# EasyEDA schematic SCH_nfcCard_2025-11-06.json
TITLE: Sheet_1; REV: 1.0; Date: 2025-11-06; Sheet: 1/1; Drawn By: thiumli; Company: Your Company
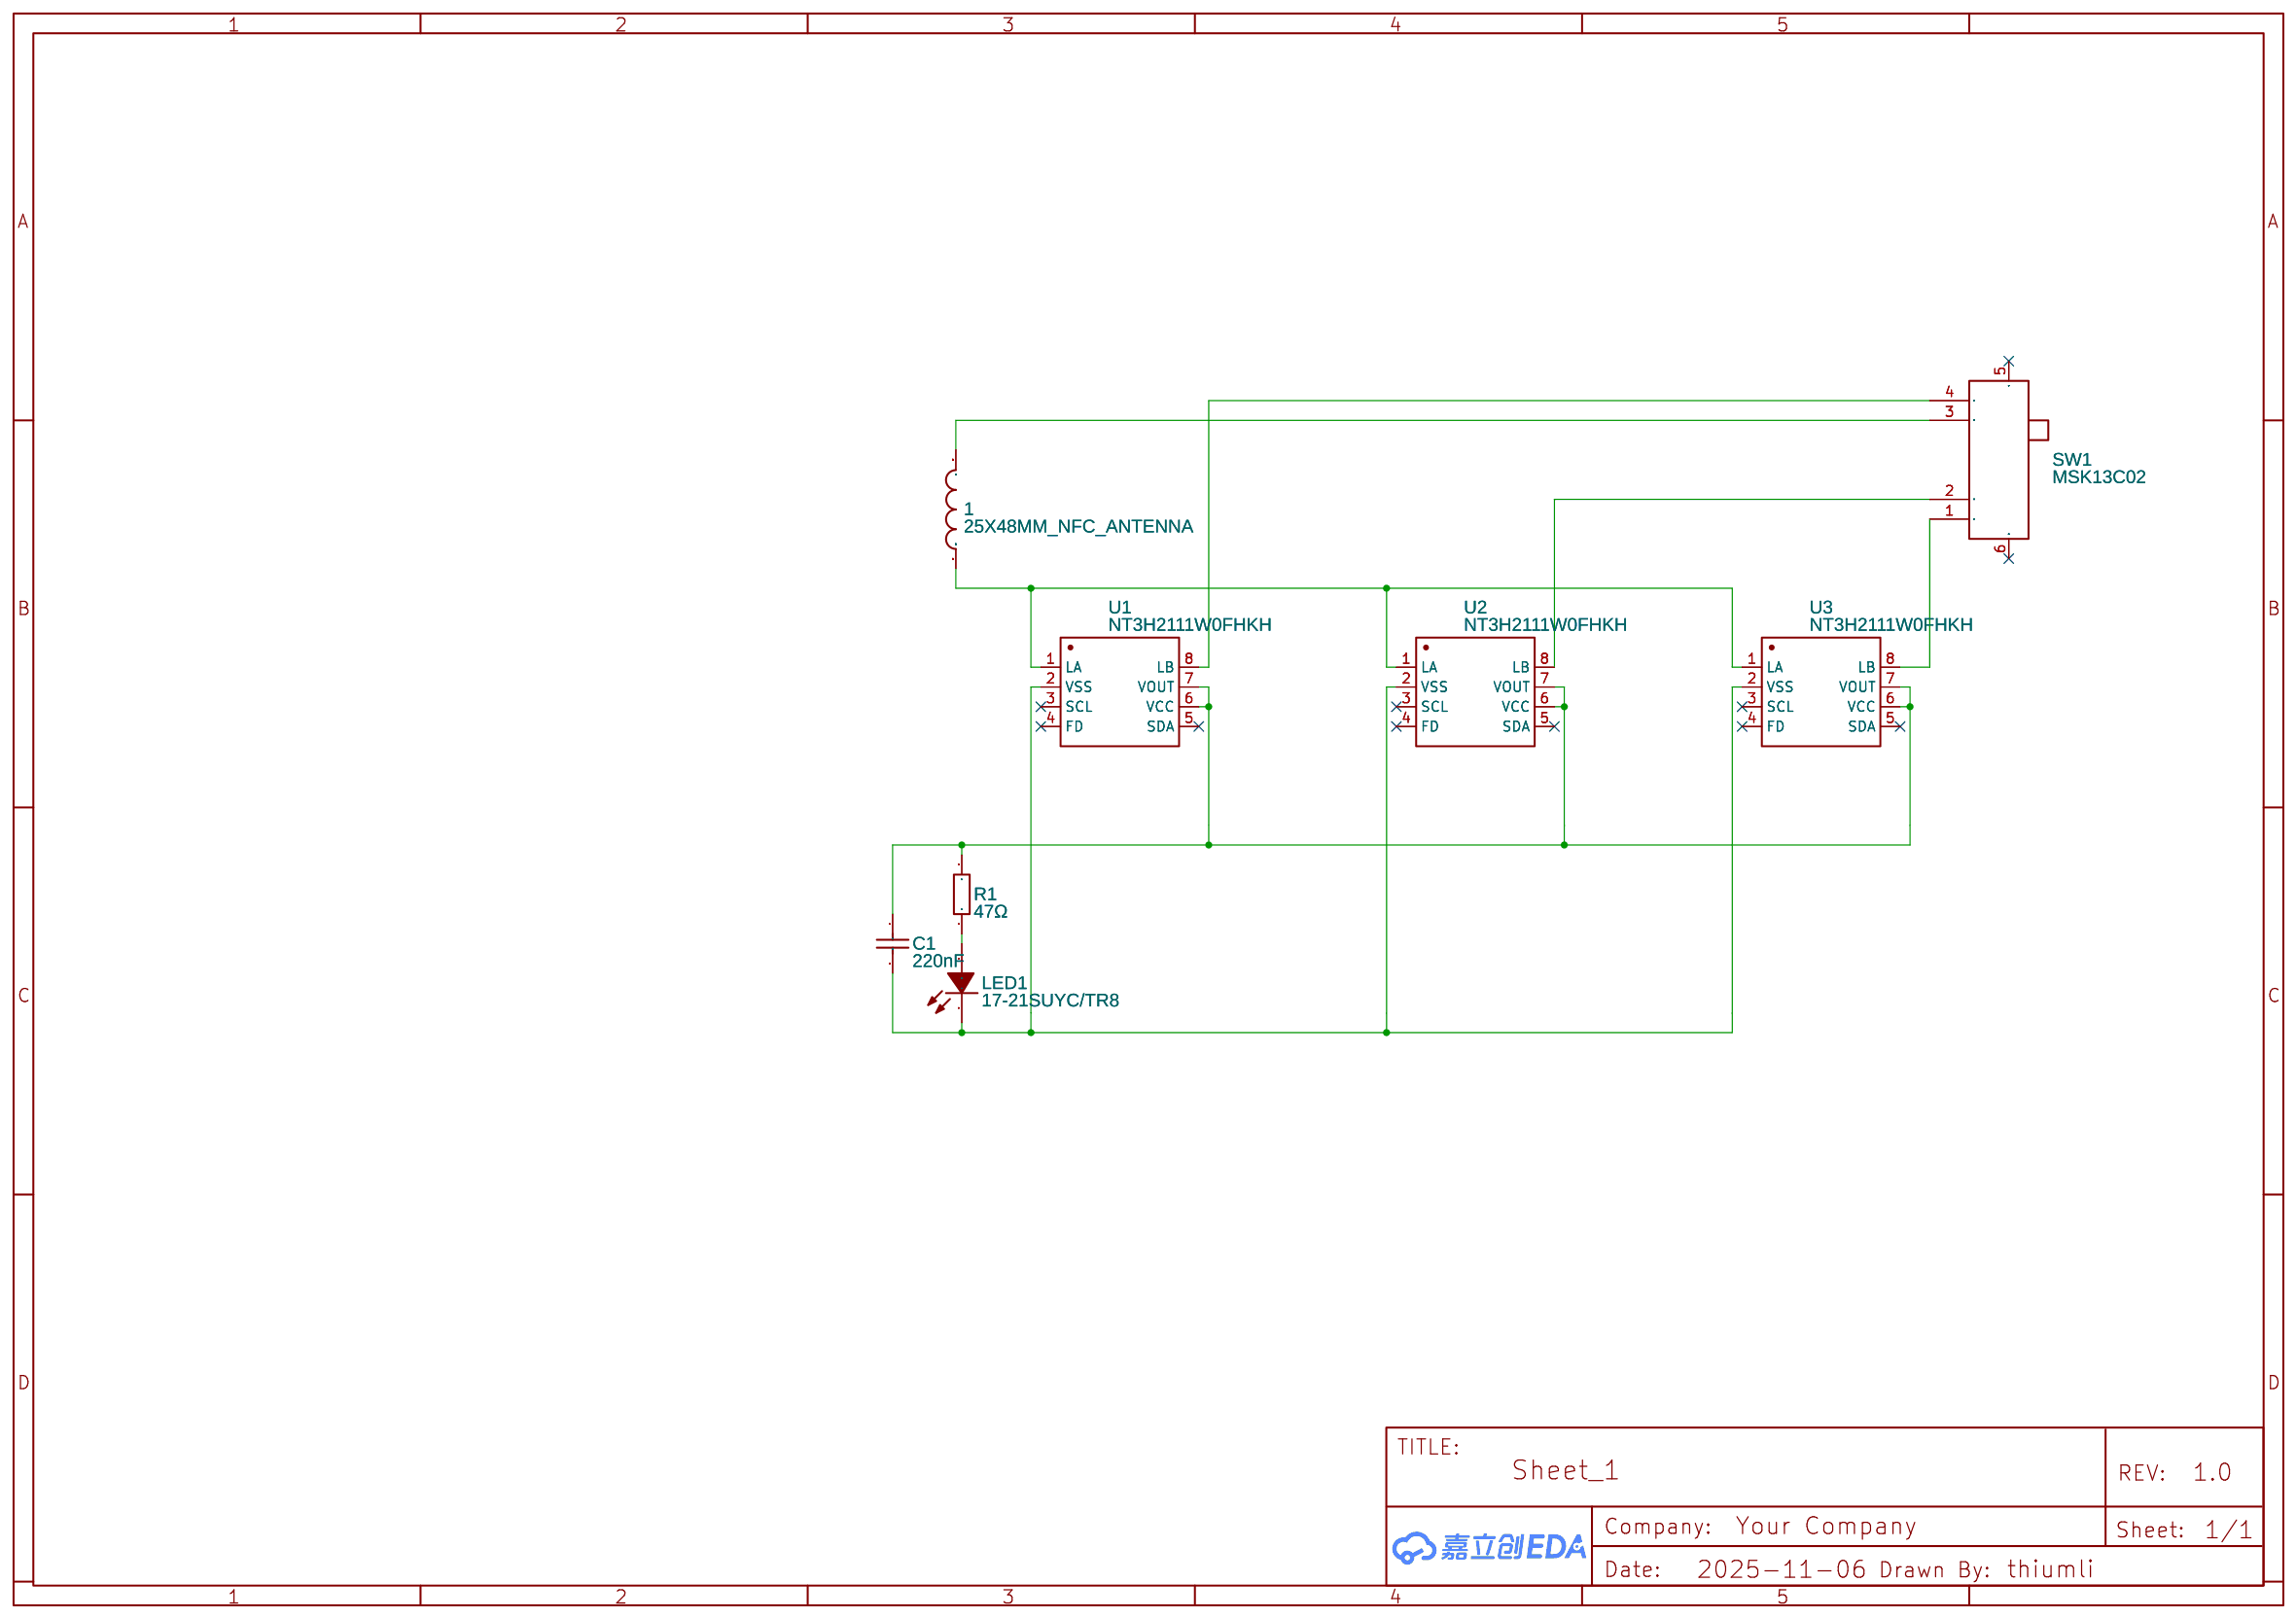
[diagram p0: schematic sheet]

## Parts
1  25X48MM_NFC_ANTENNA  [25X48MM_NFC_ANTENNA]
C1  220nF  [C0603]
LED1  17-21SUYC/TR8  [LED0805-R-RD]
R1  47Ω  [R0603]
SW1  MSK13C02  [SW-SMD_MSK13C02-SZ]
U1  NT3H2111W0FHKH  [XQFN-8_L1.6-W1.6-P0.50-BL_NT3H2111W0FHKH]
U2  NT3H2111W0FHKH  [XQFN-8_L1.6-W1.6-P0.50-BL_NT3H2111W0FHKH]
U3  NT3H2111W0FHKH  [XQFN-8_L1.6-W1.6-P0.50-BL_NT3H2111W0FHKH]

## Library data of the parts
1 = 25X48MM_NFC_ANTENNA: Contributor: svnmstrs
C1 = CL10B224KA8NNNC: Supplier: LCSC; Manufacturer: SAMSUNG(三星); Supplier Part: C21120; JLCPCB Part Class: Basic Part
LED1 = 17-21SUYC/TR8: Supplier: LCSC; Manufacturer: KENTO; Manufacturer Part: KT-0805黄灯; Supplier Part: C2296; JLCPCB Part Class: Basic Part
R1 = 0603WAF470JT5E: Supplier: LCSC; Manufacturer: UNI-ROYAL(厚声); Supplier Part: C23182; JLCPCB Part Class: Basic Part
SW1 = MSK13C02: Contributor: LCSC; Supplier: LCSC; Supplier Part: C2681567; Manufacturer: SHOU HAN(首韩); JLCPCB Part Class: Extended Part
U1-U3 = NT3H2111W0FHKH: Contributor: LCSC; Supplier: LCSC; Supplier Part: C710403; Manufacturer: NXP(恩智浦); JLCPCB Part Class: Extended Part

## Nets
Net-(1-P$1): 1.P$1 U1.1(LA) U2.1(LA) U3.1(LA)
Net-(1-P$2): 1.P$2 SW1.3
Net-(C1-1): C1.1 R1.2 U1.6(VCC) U1.7(VOUT) U2.6(VCC) U2.7(VOUT) U3.6(VCC) U3.7(VOUT)
Net-(C1-2): C1.2 LED1.2(-) U1.2(VSS) U2.2(VSS) U3.2(VSS)
Net-(LED1-1): LED1.1(+) R1.1
Net-(SW1-1): SW1.1 U3.8(LB)
Net-(SW1-2): SW1.2 U2.8(LB)
Net-(SW1-4): SW1.4 U1.8(LB)

Not connected (* = marked no-connect by the designer): SW1 5* 6*; U1 3(SCL)* 4(FD)* 5(SDA)*; U2 3(SCL)* 4(FD)* 5(SDA)*; U3 3(SCL)* 4(FD)* 5(SDA)*
